# Altium schematic sheet relay_and_led_RGB.SchDoc
size A4
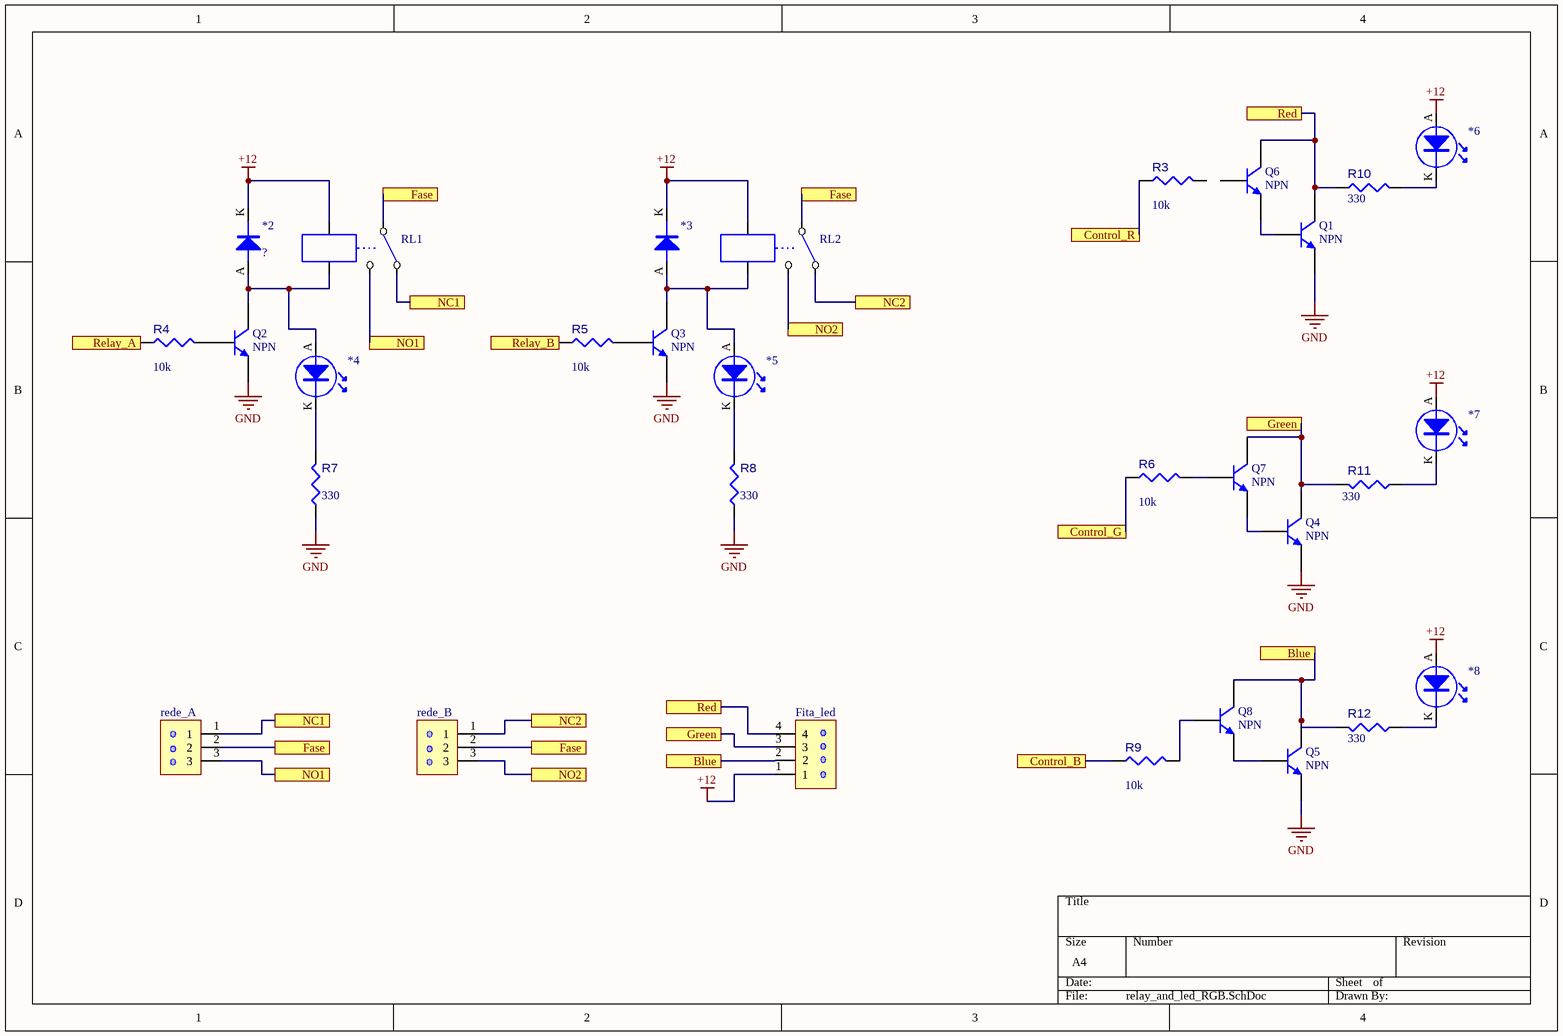
[diagram p0: relay_and_led_RGB.SchDoc]

## Parts
*2  DIO_PTH_1N4007  [DIO_PTH_DO41]  (value not drawn)
*3  DIO_PTH_1N4007  [DIO_PTH_DO41]  (value not drawn)
*4  LED_AXIAL_5MM  [HEADER_1X2]  (value not drawn)
*5  LED_AXIAL_5MM  [HEADER_1X2]  (value not drawn)
*6  LED_AXIAL_5MM  [HEADER_1X2]  (value not drawn)
*7  LED_AXIAL_5MM  [HEADER_1X2]  (value not drawn)
*8  LED_AXIAL_5MM  [HEADER_1X2]  (value not drawn)
Fita_led  CN_KK_4  [CN_KK_4_5045-4]  (value not drawn)
Q1  NPN  [HEADER_1X3]
Q2  NPN  [HEADER_1X3]
Q3  NPN  [HEADER_1X3]
Q4  NPN  [HEADER_1X3]
Q5  NPN  [HEADER_1X3]
Q6  NPN  [HEADER_1X3]
Q7  NPN  [HEADER_1X3]
Q8  NPN  [HEADER_1X3]
R3  10k  [RES_PTH_7.62MM]
R4  10k  [RES_PTH_7.62MM]
R5  10k  [RES_PTH_7.62MM]
R6  10k  [RES_PTH_7.62MM]
R7  330  [RES_PTH_7.62MM]
R8  330  [RES_PTH_7.62MM]
R9  10k  [RES_PTH_7.62MM]
R10  330  [RES_PTH_7.62MM]
R11  330  [RES_PTH_7.62MM]
R12  330  [RES_PTH_7.62MM]
rede_A  ?  [CN_KRE_3]  (value not drawn)
rede_B  ?  [CN_KRE_3]  (value not drawn)
RL1  RELEICR5551  [DIV_RELE_5551]  (value not drawn)
RL2  RELEICR5551  [DIV_RELE_5551]  (value not drawn)

## Ports
Blue, Control_B, Control_G, Control_R, Fase, Green, NC1, NC2, NO1, NO2, Red, Relay_A, Relay_B

## Nets
+12: *2.K *3.K *6.A *7.A *8.A Fita_led.1 RL1.4 RL2.4
GND: Q1.3(E) Q2.3(E) Q3.3(E) Q4.3(E) Q5.3(E) R7.1 R8.1
Blue: Fita_led.2 Q5.1(C) Q8.1(C) R12.2 ; port Blue
Control_B: R9.1 ; port Control_B
Control_G: R6.1 ; port Control_G
Control_R: R3.1 ; port Control_R
Fase: rede_A.2 rede_B.2 RL1.1 RL2.1 ; port Fase
Green: Fita_led.3 Q4.1(C) Q7.1(C) R11.2 ; port Green
NC1: rede_A.1 RL1.2 ; port NC1
NC2: rede_B.1 RL2.2 ; port NC2
NO1: rede_A.3 RL1.3 ; port NO1
NO2: rede_B.3 RL2.3 ; port NO2
Red: Fita_led.4 Q1.1(C) Q6.1(C) R10.1 ; port Red
Relay_A: R4.1 ; port Relay_A
Relay_B: R5.1 ; port Relay_B
Net*2_A: *2.A *4.A Q2.1(C) RL1.5
Net*3_A: *3.A *5.A Q3.1(C) RL2.5
Net*4_K: *4.K R7.2
Net*5_K: *5.K R8.2
Net*6_K: *6.K R10.2
Net*7_K: *7.K R11.1
Net*8_K: *8.K R12.1
NetQ1_2: Q1.2(B) Q6.3(E)
NetQ2_2: Q2.2(B) R4.2
NetQ3_2: Q3.2(B) R5.2
NetQ4_2: Q4.2(B) Q7.3(E)
NetQ5_2: Q5.2(B) Q8.3(E)
NetQ7_2: Q7.2(B) R6.2
NetQ8_2: Q8.2(B) R9.2

Not connected (* = marked no-connect by the designer): Q6 2(B); R3 2

## Library data of the parts
*4-*8 = LED_AXIAL_5MM: pin to pad: A>1 K>2; Value: ?
Fita_led = CN_KK_4: KK_4; Value: ?
Q1 Q4-Q8 = NPN: NPN Bipolar Transistor; pin to pad: 1>2 2>1; Published: 8-Jun-2000; LatestRevisionDate: 17-Jul-2002; LatestRevisionNote: Re-released for DXP Platform.; PackageReference: TO-226-AA; Publisher: Altium Limited; PackageDescription: TO, Flat Index; 3 In-Line, Axial Leads; Body Dia. 4.8mm; Leads 0.55 x 0.51 mm (max); Code_JEDEC: TO-226-AA
Q2 Q3 = NPN: NPN Bipolar Transistor; Published: 8-Jun-2000; LatestRevisionDate: 17-Jul-2002; LatestRevisionNote: Re-released for DXP Platform.; PackageReference: TO-226-AA; Publisher: Altium Limited; PackageDescription: TO, Flat Index; 3 In-Line, Axial Leads; Body Dia. 4.8mm; Leads 0.55 x 0.51 mm (max); Code_JEDEC: TO-226-AA
R3-R12 = RES_PTH_7.62MM: Pin Through Hole Resistor 7.62mm
  R3-R6 R9: Value: 10k
  R7 R8 R10-R12: Value: 330
rede_A rede_B = CN_MKDS_3: MKDS_3; Value: ?
*2 *3 = DIO_PTH_1N4007: Value: ?
RL1 RL2 = RELEICR5551: Value: RELEICR5551